# EAGLE design Ahmeduino Project (EAGLE 9.5.1)
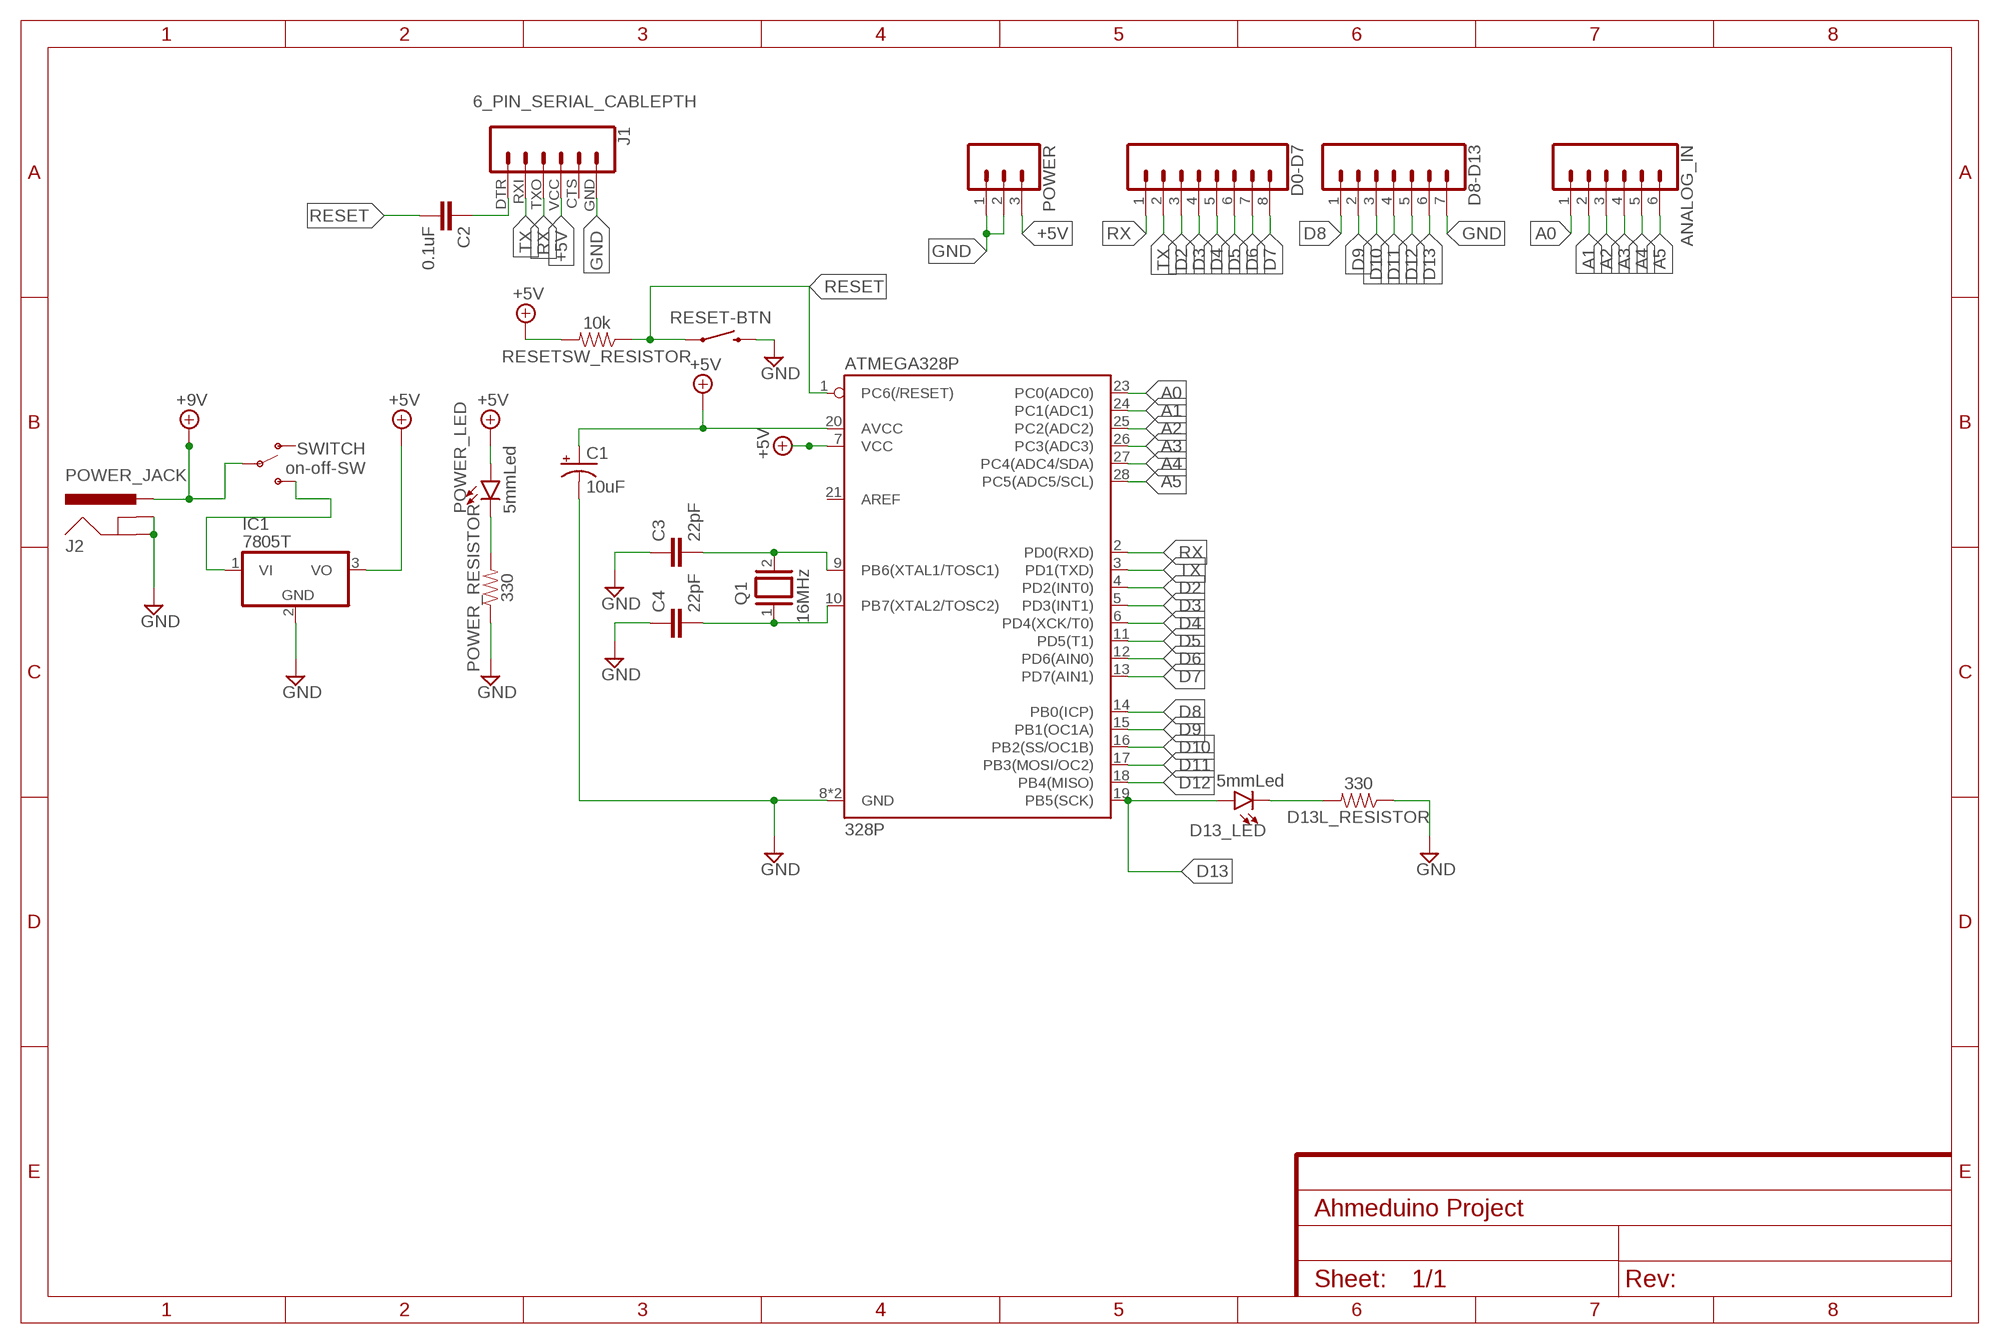
[diagram p0: schematic, sheet 1]

## Parts
ANALOG_IN  CONN_06LONGPADS  [1X06_LONGPADS]
ATMEGA328P  328P  ATMEGA328P_PDIP  [DIP28]
C1  10uF  10UF-POLAR-RADIAL-2.5MM-25V-20%  [CPOL-RADIAL-2.5MM-5MM]
C2  0.1uF  0.1UF-KIT-EZ-50V-20%  [CAP-PTH-SMALL-KIT]
C3  22pF  22PF-PTH-2.54MM-200V-5%  [CAP-PTH-2.54]
C4  22pF  22PF-PTH-2.54MM-200V-5%  [CAP-PTH-2.54]
D0-D7  CONN_08LONGPADS  [1X08_LONGPADS]
D8-D13  CONN_07LONGPADS  [1X07_LONGPADS]
D13_LED  5mmLed  LED5MM  [LED_5MM]
D13L_RESISTOR  330  330OHM-HORIZ-1/10W-5%  [AXIAL-0.3]
IC1  7805T  [TO220H]
J1  6_PIN_SERIAL_CABLEPTH  [FTDI_BASIC]
J2  POWER_JACK  [POWER_JACK_PTH]
POWER  CONN_03LONGPADS  [1X03_LONGPADS]
POWER_LED  5mmLed  LED5MM  [LED_5MM]
POWER_RESISTOR  330  330OHM-HORIZ-1/10W-5%  [AXIAL-0.3]
Q1  16MHz  XTAL/S  [QS]
RESET-BTN  ResetBtn  MOMENTARY-SWITCH-SPST-PTH-6.0MM  [TACTILE_SWITCH_PTH_6.0MM]
RESETSW_RESISTOR  10k  10KOHM-HORIZ-1/4W-1%  [AXIAL-0.3]
SWITCH  on-off-SW  SWITCH-SPDT-PTH-11.6X4.0MM  [SWITCH_SPDT_PTH_11.6X4.0MM]

## Nets
+5V: ATMEGA328P.7(VCC) ATMEGA328P.20(AVCC) C1.1(+) IC1.3(VO) J1.VCC POWER.3 POWER_LED.A RESETSW_RESISTOR.P$2
+9V: J2.PWR SWITCH.2(P)
A0: ANALOG_IN.1 ATMEGA328P.23(PC0(ADC0))
A1: ANALOG_IN.2 ATMEGA328P.24(PC1(ADC1))
A2: ANALOG_IN.3 ATMEGA328P.25(PC2(ADC2))
A3: ANALOG_IN.4 ATMEGA328P.26(PC3(ADC3))
A4: ANALOG_IN.5 ATMEGA328P.27(PC4(ADC4/SDA))
A5: ANALOG_IN.6 ATMEGA328P.28(PC5(ADC5/SCL))
D2: ATMEGA328P.4(PD2(INT0)) D0-D7.3
D3: ATMEGA328P.5(PD3(INT1)) D0-D7.4
D4: ATMEGA328P.6(PD4(XCK/T0)) D0-D7.5
D5: ATMEGA328P.11(PD5(T1)) D0-D7.6
D6: ATMEGA328P.12(PD6(AIN0)) D0-D7.7
D7: ATMEGA328P.13(PD7(AIN1)) D0-D7.8
D8: ATMEGA328P.14(PB0(ICP)) D8-D13.1
D9: ATMEGA328P.15(PB1(OC1A)) D8-D13.2
D10: ATMEGA328P.16(PB2(SS/OC1B)) D8-D13.3
D11: ATMEGA328P.17(PB3(MOSI/OC2)) D8-D13.4
D12: ATMEGA328P.18(PB4(MISO)) D8-D13.5
D13: ATMEGA328P.19(PB5(SCK)) D8-D13.6 D13_LED.A
GND: ATMEGA328P.8(GND) ATMEGA328P.22(GND) C1.2(-) C3.1 C4.1 D8-D13.7 D13L_RESISTOR.P$1 IC1.2(GND) J1.GND J2.GND J2.GNDBREAK POWER.1 POWER.2 POWER_RESISTOR.P$1 RESET-BTN.3
N$1: ATMEGA328P.9(PB6(XTAL1/TOSC1)) C3.2 Q1.2
N$2: ATMEGA328P.10(PB7(XTAL2/TOSC2)) C4.2 Q1.1
N$3: C2.1 J1.DTR
N$4: IC1.1(VI) SWITCH.3(S)
N$5: POWER_LED.K(C) POWER_RESISTOR.P$2
N$6: D13_LED.K(C) D13L_RESISTOR.P$2
RESET: ATMEGA328P.1(PC6(/RESET)) C2.2 RESET-BTN.1 RESETSW_RESISTOR.P$1
RX: ATMEGA328P.2(PD0(RXD)) D0-D7.1 J1.TXO
TX: ATMEGA328P.3(PD1(TXD)) D0-D7.2 J1.RXI
Unconnected: ATMEGA328P.21(AREF) J1.CTS SWITCH.1(O)

## Library data of the parts
ANALOG_IN = SparkFun-Connectors:CONN_06: Multi connection point. Often used as Generic Header-pin footprint for 0.1 inch spaced/style header connections On any of the 0.1 inch spaced packages, you can populate with these: Break Away Headers - Straight <https://www.sparkfun.com/products/116> (PRT-00116) Break Away Male Headers - Right Angle <https://www.sparkfun.com/products/553> (PRT-00553) Female Headers <https://www.sparkfun.com/products/115> (PRT-00115) Break Away Headers - Machine Pin <https://www.sparkfun.com/products/117> (PRT-00117) Break Away Female Headers - Swiss Machine Pin <https://www.sparkfun.com/products/743> (PRT-00743) Arduino Stackable Header - 6 Pin <https://www.sparkfun.com/products/9280> (PRT-09280) For SCREWTERMINALS and SPRING TERMINALS visit here: Screw Terimnals on SparkFun.com <https://www.sparkfun.com/search/results?term=Screw+Terminals> (5mm/3.5mm/2.54mm spacing) This device is also useful as a general connection point to wire up your design to another part of your project. Our various solder wires solder well into these plated through hole pads. Hook-Up Wire - Assortment (Stranded, 22 AWG) <https://www.sparkfun.com/products/11375> (PRT-11375) Hook-Up Wire - Assortment (Solid Core, 22 AWG) <https://www.sparkfun.com/products/11367> (PRT-11367) View the entire wire category on our website here <https://www.sparkfun.com/categories/141>
ATMEGA328P = SparkFun-IC-Microcontroller:ATMEGA328P_PDIP: Atmel 328P Through hole ATMEGA328P uC used in the Arduino 32kb flash, 1k EEPROM, 2k SRAM Datasheet <http://www.sparkfun.com/datasheets/Components/SMD/ATMega328.pdf> SparkFun Products Storefront component: AVR 28 Pin 20MHz 32K 6A/D - ATMega328P <https://www.sparkfun.com/products/9061> (COM-09061) SparkFun Simon Says - Through-Hole Soldering Kit <https://www.sparkfun.com/products/10547> (KIT-10547) SparkFun Learn to Solder - Simon Says <https://www.sparkfun.com/products/13708> (KIT-13708) SparkFun BigTime Watch Kit <https://www.sparkfun.com/products/11734> (KIT-11734) SparkFun ClockIt <https://www.sparkfun.com/products/10930> (KIT-10930) SparkFun Serial Enabled LCD Kit <https://www.sparkfun.com/products/10097> (LCD-10097) SparkFun Simon Tilts - Through Hole Soldering Kit <https://www.sparkfun.com/products/12634> (KIT-12634) SparkFun Frequency Counter Kit <https://www.sparkfun.com/products/10140> (KIT-10140) FabFM Radio Kit <https://www.sparkfun.com/products/11043> (KIT-11043) SparkFun Binary Blaster Kit <https://www.sparkfun.com/products/12037> (KIT-12037) SparkFun Metro-Gnome <https://www.sparkfun.com/products/9236> (KIT-09236) ATmega328 with Arduino Optiboot (Uno) <https://www.sparkfun.com/products/10524> (DEV-10524); PROD_ID: IC-09136
C1 = SparkFun-Capacitors:10UF-POLAR: 10.0µF polarized capacitors A capacitor is a passive two-terminal electrical component used to store electrical energy temporarily in an electric field.; PROD_ID: CAP-08440
C2 = SparkFun-Capacitors:0.1UF: 0.1µF ceramic capacitors A capacitor is a passive two-terminal electrical component used to store electrical energy temporarily in an electric field.; PROD_ID: CAP-08370
C3 C4 = SparkFun-Capacitors:22PF: 22pF ceramic capacitors A capacitor is a passive two-terminal electrical component used to store electrical energy temporarily in an electric field.; PROD_ID: CAP-09128
D0-D7 = SparkFun-Connectors:CONN_08: Multi connection point. Often used as Generic Header-pin footprint for 0.1 inch spaced/style header connections On any of the 0.1 inch spaced packages, you can populate with these: Break Away Headers - Straight <https://www.sparkfun.com/products/116> (PRT-00116) Break Away Male Headers - Right Angle <https://www.sparkfun.com/products/553> (PRT-00553) Female Headers <https://www.sparkfun.com/products/115> (PRT-00115) Break Away Headers - Machine Pin <https://www.sparkfun.com/products/117> (PRT-00117) Break Away Female Headers - Swiss Machine Pin <https://www.sparkfun.com/products/743> (PRT-00743) Arduino Stackable Header - 8 Pin <https://www.sparkfun.com/products/9279> (PRT-09279) For SCREWTERMINALS and SPRING TERMINALS visit here: Screw Terimnals on SparkFun.com <https://www.sparkfun.com/search/results?term=Screw+Terminals> (5mm/3.5mm/2.54mm spacing) This device is also useful as a general connection point to wire up your design to another part of your project. Our various solder wires solder well into these plated through hole pads. Hook-Up Wire - Assortment (Stranded, 22 AWG) <https://www.sparkfun.com/products/11375> (PRT-11375) Hook-Up Wire - Assortment (Solid Core, 22 AWG) <https://www.sparkfun.com/products/11367> (PRT-11367) View the entire wire category on our website here <https://www.sparkfun.com/categories/141> Special notes: Molex polarized connector foot print use with SKU : PRT-08231 with associated crimp pins and housings. 1MM SMD Version SKU: PRT-10208 NOTES ON THE VARIANTS LOCK and LOCK_LONGPADS... This footprint was designed to help hold the alignment of a through-hole component (i.e. 6-pin header) while soldering it into place. You may notice that each hole has been shifted either up or down by 0.005 of an inch from it's more standard position (which is a perfectly straight line). This slight alteration caused the pins (the squares in the middle) to touch the edges of the holes. Because they are alternating, it causes a "brace" to hold the component in place. 0.005 has proven to be the perfect amount of "off-center" position when using our standard breakaway headers. Although looks a little odd when you look at the bare footprint, once you have a header in there, the alteration is very hard to notice. Also,if you push a header all the way into place, it is covered up entirely on the bottom side.
D8-D13 = SparkFun-Connectors:CONN_07: Multi connection point. Often used as Generic Header-pin footprint for 0.1 inch spaced/style header connections On any of the 0.1 inch spaced packages, you can populate with these: Break Away Headers - Straight <https://www.sparkfun.com/products/116> (PRT-00116) Break Away Male Headers - Right Angle <https://www.sparkfun.com/products/553> (PRT-00553) Female Headers <https://www.sparkfun.com/products/115> (PRT-00115) Break Away Headers - Machine Pin <https://www.sparkfun.com/products/117> (PRT-00117) Break Away Female Headers - Swiss Machine Pin <https://www.sparkfun.com/products/743> (PRT-00743) For SCREWTERMINALS and SPRING TERMINALS visit here: Screw Terimnals on SparkFun.com <https://www.sparkfun.com/search/results?term=Screw+Terminals> (5mm/3.5mm/2.54mm spacing) This device is also useful as a general connection point to wire up your design to another part of your project. Our various solder wires solder well into these plated through hole pads. Hook-Up Wire - Assortment (Stranded, 22 AWG) <https://www.sparkfun.com/products/11375> (PRT-11375) Hook-Up Wire - Assortment (Solid Core, 22 AWG) <https://www.sparkfun.com/products/11367> (PRT-11367) View the entire wire category on our website here <https://www.sparkfun.com/categories/141> Special notes: Molex polarized connector foot print use with SKU : PRT-08231 with associated crimp pins and housings. 1MM SMD Version SKU: PRT-10208 NOTES ON THE VARIANTS LOCK and LOCK_LONGPADS... This footprint was designed to help hold the alignment of a through-hole component (i.e. 6-pin header) while soldering it into place. You may notice that each hole has been shifted either up or down by 0.005 of an inch from it's more standard position (which is a perfectly straight line). This slight alteration caused the pins (the squares in the middle) to touch the edges of the holes. Because they are alternating, it causes a "brace" to hold the component in place. 0.005 has proven to be the perfect amount of "off-center" position when using our standard breakaway headers. Although looks a little odd when you look at the bare footprint, once you have a header in there, the alteration is very hard to notice. Also,if you push a header all the way into place, it is covered up entirely on the bottom side.
D13_LED POWER_LED = SparkFun-LED:LED: LED (Generic) Standard schematic elements and footprints for 5mm, 3mm, 1206, and 0603 sized LEDs. Generic LEDs with no color specified.
D13L_RESISTOR POWER_RESISTOR = SparkFun-Resistors:330OHM: 330Ω resistor A resistor is a passive two-terminal electrical component that implements electrical resistance as a circuit element. Resistors act to reduce current flow, and, at the same time, act to lower voltage levels within circuits. - Wikipedia; PROD_ID: RES-8371
IC1 = linear:78*: Positive VOLTAGE REGULATOR Source: http://cache.national.com/ds/LM/LM78L05.pdf http://www.fairchildsemi.com/ds/LM/LM7805.pdf
J1 = SparkFun-Connectors:6_PIN_SERIAL_CABLE: 6-pin header connection for use with the "FTDI BASIC" pinout - CABLE SIDE. Also known as "Arduino Serial Program Header". This is used on a design to provide a 6-pin connection point for serial communication usually from a USB cable (D+/D-) to these headers (RX/TX). It also has the remaining pins necessary for programming in the Arduino evironment (DTR, GND, and sometimes VCC). Note, this device has "CABLE" in the name. It is intended to be used on a design that usually lives on the end of your USB cable and prvides the converter chip (FTDI232 or FTDI231x) to commnicate serial RX/TX. The "sister" device, named "TARGET" is inteneded to be used on a design that contains a target micro-controller that you wish to program. You can populate with some of these: Female Headers <https://www.sparkfun.com/products/115> (PRT-00115) For reference (or to suit your programming needs) check out these designs: SparkFun FTDI Basic Breakout - 5V <https://www.sparkfun.com/products/9716> (DEV-09716) SparkFun FTDI Basic Breakout - 3.3V <https://www.sparkfun.com/products/9873> (DEV-09873) SparkFun FTDI SmartBasic <https://www.sparkfun.com/products/12935> (DEV-12935) SparkFun Beefy 3 - FTDI Basic Breakout <https://www.sparkfun.com/products/13746> (DEV-13746)
J2 = SparkFun-Connectors:POWER_JACK: Power Jack Connector This is the standard 5.5mm barrel jack for power. The PTH is the most common, proven, reliable, footprint. The Slot footprint only works if the mill layer is transmitted to the PCB fab house so be warned. Here are the connectors we sell at SparkFun: DC Barrel Power Jack/Connector <https://www.sparkfun.com/products/119> (PRT-00119) DC Barrel Power Jack/Connector (SMD) <https://www.sparkfun.com/products/12748> (PRT-12748) DC Barrel Jack Adapter - Breadboard Compatible <https://www.sparkfun.com/products/10811> (PRT-10811) It is used on this SparkFun product (and many, many others): SparkFun RedBoard - Programmed with Arduino <https://www.sparkfun.com/products/12757> (DEV-12757) Also, if you need a mating power supply or connector, please check these out: Wall Adapter Power Supply - 9VDC 650mA <https://www.sparkfun.com/products/298> (TOL-00298) DC Barrel Jack Adapter - Male <https://www.sparkfun.com/products/10287> (PRT-10287); PROD_ID: CONN-08197
POWER = SparkFun-Connectors:CONN_03: Multi connection point. Often used as Generic Header-pin footprint for 0.1 inch spaced/style header connections On any of the 0.1 inch spaced packages, you can populate with these: Break Away Headers - Straight <https://www.sparkfun.com/products/116> (PRT-00116) Break Away Male Headers - Right Angle <https://www.sparkfun.com/products/553> (PRT-00553) Female Headers <https://www.sparkfun.com/products/115> (PRT-00115) Break Away Headers - Machine Pin <https://www.sparkfun.com/products/117> (PRT-00117) Break Away Female Headers - Swiss Machine Pin <https://www.sparkfun.com/products/743> (PRT-00743) Stackable Header - 3 Pin (Female, 0.1") <https://www.sparkfun.com/products/13875> (PRT-13875) For SCREWTERMINALS and SPRING TERMINALS visit here: Screw Terimnals on SparkFun.com <https://www.sparkfun.com/search/results?term=Screw+Terminals> (5mm/3.5mm/2.54mm spacing) This device is also useful as a general connection point to wire up your design to another part of your project. Our various solder wires solder well into these plated through hole pads. Hook-Up Wire - Assortment (Stranded, 22 AWG) <https://www.sparkfun.com/products/11375> (PRT-11375) Hook-Up Wire - Assortment (Solid Core, 22 AWG) <https://www.sparkfun.com/products/11367> (PRT-11367) View the entire wire category on our website here <https://www.sparkfun.com/categories/141> Special notes: Molex polarized connector foot print use with SKU : PRT-08232 with associated crimp pins and housings.
Q1 = special:XTAL/S: CRYSTAL
RESET-BTN = SparkFun-Switches:MOMENTARY-SWITCH-SPST: Momentary Switch (Pushbutton) - SPST Normally-open (NO) SPST momentary switches (buttons, pushbuttons). Variants PTH-12MM - 12mm square, through-hole Momentary Pushbutton Switch - 12mm Square <https://www.sparkfun.com/products/9190> (COM-09190) PTH-6.0MM, PTH-6.0MM-KIT - 6.0mm square, through-hole Mini Pushbutton Switch <https://www.sparkfun.com/products/97> (COM-00097) KIT package intended for soldering kit's - only one side of pads' copper is exposed. PTH-RIGHT-ANGLE-KIT - Right-angle, through-hole Right Angle Tactile Button <https://www.sparkfun.com/products/10791> - Used on SparkFun BigTime Watch Kit <https://www.sparkfun.com/products/11734> SMD-12MM - 12mm square, surface-mount Tactile Button - SMD (12mm) <https://www.sparkfun.com/products/12993> (COM-12993) Used on SparkFun PicoBoard <https://www.sparkfun.com/products/11888> SMD-4.5MM - 4.5mm Square Trackball Switch Used on SparkFun Blackberry Trackballer Breakout <https://www.sparkfun.com/products/13169> SMD-4.6MMX2.8MM - 4.60mm x 2.80mm, surface mount Used on SparkFun SAMD21 Mini Breakout <https://www.sparkfun.com/products/13664> SMD-5.2MM, SMD-5.2-REDUNDANT - 5.2mm square, surface-mount Mini Pushbutton Switch - SMD <https://www.sparkfun.com/products/8720> (COM-08720) Used on Arduino Pro Mini <https://www.sparkfun.com/products/11114> REDUNDANT package connects both switch circuits together SMD-6.0X3.5MM - 6.0 x 3.5mm, surface mount Momentary Reset Switch SMD <https://www.sparkfun.com/products/8229> (COM-08229) SMD-6.2MM-TALL - 6.2mm square, surface mount Tactile Button - SMD (6mm) <https://www.sparkfun.com/products/12992> Used on SparkFun Digital Sandbox <https://www.sparkfun.com/products/12651> SMD-RIGHT-ANGLE - Right-angle, surface mount Used on SparkFun Block for Intel® Edison - Arduino <https://www.sparkfun.com/products/13036>; PROD_ID: SWCH-08441; SF_SKU: COM-00097
RESETSW_RESISTOR = SparkFun-Resistors:10KOHM: 10kΩ resistor A resistor is a passive two-terminal electrical component that implements electrical resistance as a circuit element. Resistors act to reduce current flow, and, at the same time, act to lower voltage levels within circuits. - Wikipedia; PROD_ID: RES-12183
SWITCH = SparkFun-Switches:SWITCH-SPDT: Single Pole, Double Throw (SPDT) Switch Single-pole, double-throw (SPDT) switch. Variant Overview SMD-AYZ0202 Surface Mount DPDT Switch <https://www.sparkfun.com/products/597> (COM-00597) Used on e.g. LilyPad Arduino USB - ATmega32U4 Board <https://www.sparkfun.com/products/12049> PTH-11.6X4.0MM SPDT Mini Power Switch <https://www.sparkfun.com/products/102> (COM-00102) Used on e.g. SparkFun Simon Says - Through-Hole Soldering Kit <https://www.sparkfun.com/products/10547> (KIT-10547) PTH-11.6X4.0MM-KIT KIT version of SPDT Mini Power Switch - Simplifies soldering by removing tStop of switch pins - only one side can be soldered. PTH-11.6X4.0MM-LOCK LOCK version of SPDT Mini Power Switch - Offset pins hold switch in place for easier soldering. SMD-RIGHT-ANGLE Surface Mount Right Angle Switch <https://www.sparkfun.com/products/10860> (COM-10860) Used on e.g. SparkFun ESP8266 Thing <https://www.sparkfun.com/products/13231>; PROD_ID: SWCH-08261; SF_SKU: COM-00102

## Board
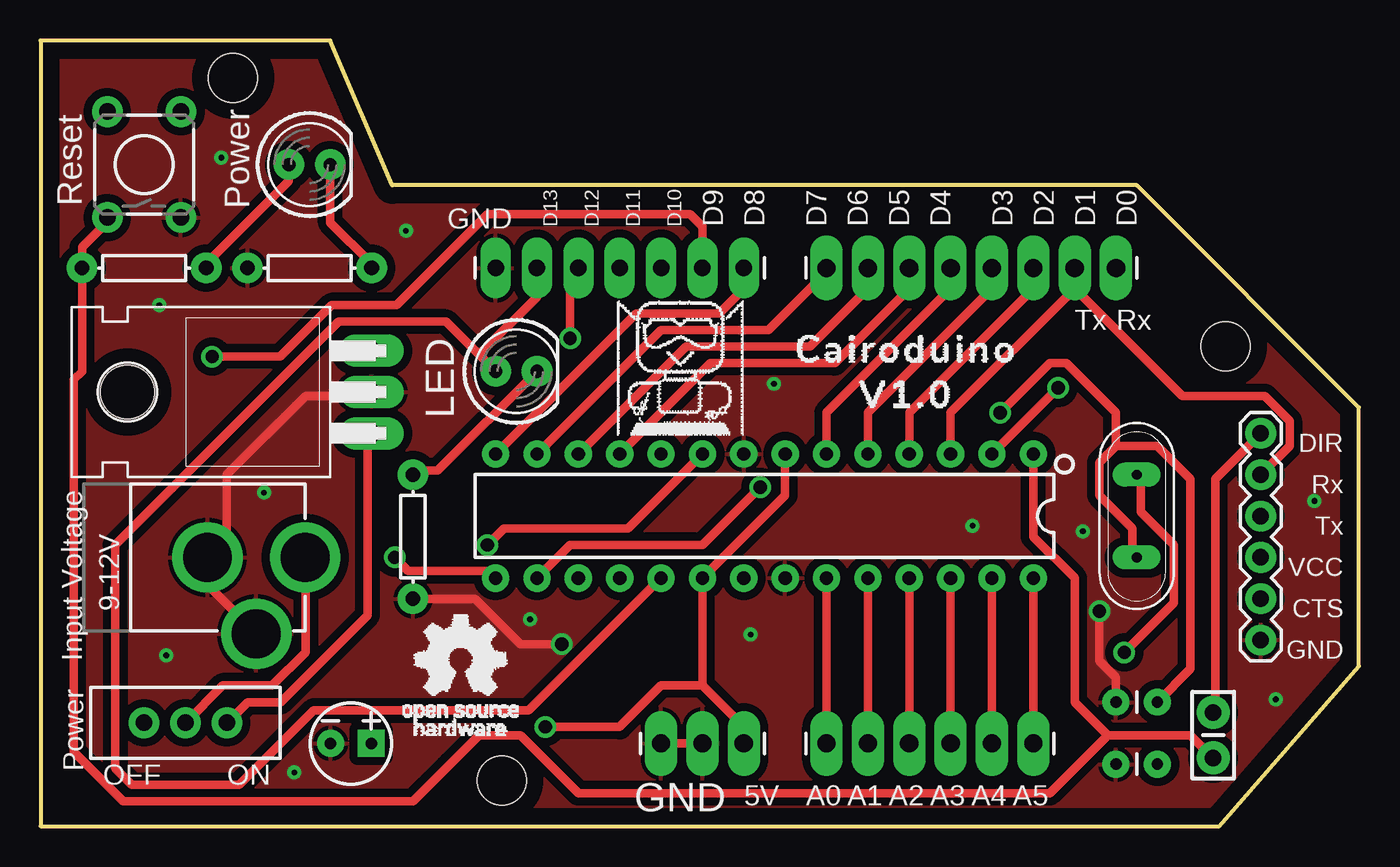
[diagram p1: board, top side]
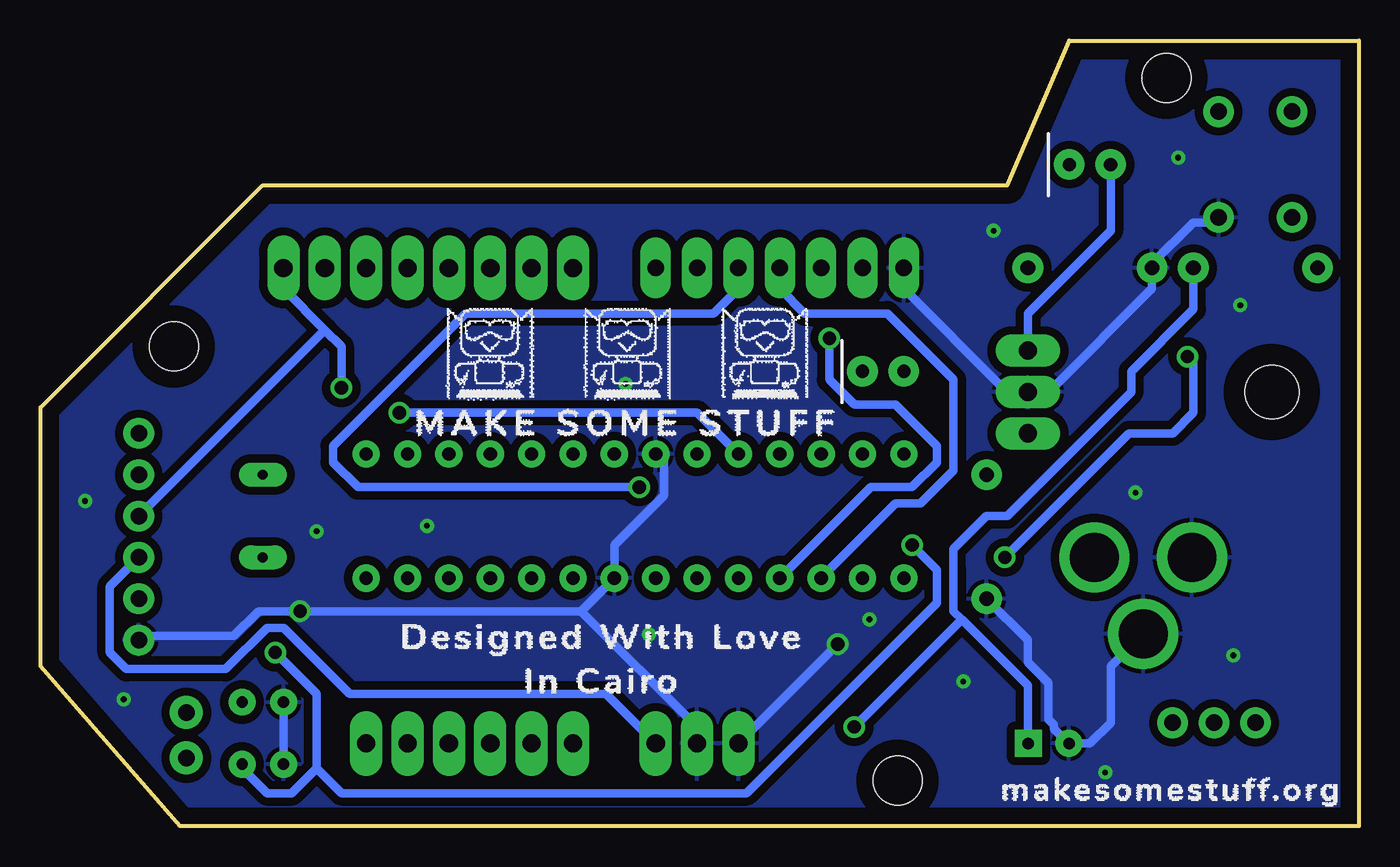
[diagram p2: board, bottom side, seen from below]

Size 80.95 x 48.25 mm. Coordinates in mm from the lower left corner, seen from the top.
Outline: 0,0 72.39,0 80.95,9.83 80.95,25.73 67.32,39.36 21.59,39.37 17.79,48.25 0,48.25 0,0
Copper layers (1*16): Top 0.035mm / dielectric 1.5mm / Bottom 0.035mm
Design rules "default *": minimum track width 20mil, minimum drill 0.8mm, track to track 20mil, track to pad 20mil, pad to pad 20mil, via to via 20mil, smd to smd 20mil, copper to edge 40mil, drill to drill 6mil, minimum pad ring 17mil, minimum via ring 10mil, stop-mask expansion 4mil, vias tented up to drill 0mil, thermal gap 10mil
Holes 3 mm at 11.81,45.97 28.32,2.79 72.77,29.46

### Footprints (pad centres in the part's own frame; a part is rotated, then mirrored left to right if it is on the bottom)
1X06_LONGPADS = drill 1.118 pad 1.88 long: 1 0,0; 2 2.54,0; 3 5.08,0; 4 7.62,0; 5 10.16,0; 6 12.7,0
DIP28 = drill 0.813 pad 1.626: 1 -16.51,-3.81; 2 -13.97,-3.81; 3 -11.43,-3.81; 4 -8.89,-3.81; 5 -6.35,-3.81; 6 -3.81,-3.81; 7 -1.27,-3.81; 8 1.27,-3.81; 9 3.81,-3.81; 10 6.35,-3.81; 11 8.89,-3.81; 12 11.43,-3.81; 13 13.97,-3.81; 14 16.51,-3.81; 15 16.51,3.81; 16 13.97,3.81; 17 11.43,3.81; 18 8.89,3.81; 19 6.35,3.81; 20 3.81,3.81; 21 1.27,3.81; 22 -1.27,3.81; 23 -3.81,3.81; 24 -6.35,3.81; 25 -8.89,3.81; 26 -11.43,3.81; 27 -13.97,3.81; 28 -16.51,3.81
CPOL-RADIAL-2.5MM-5MM = drill 0.7 pad 1.651 square: 1 1.25,0 | drill 0.7 pad 1.651: 2 -1.25,0
CAP-PTH-SMALL-KIT = drill 1.016 pad 2.032: 1 -1.397,0; 2 1.397,0
CAP-PTH-2.54 = drill 0.7 pad 1.651: 1 -1.27,0; 2 1.27,0
1X08_LONGPADS = drill 1.118 pad 1.88 long: 1 0,0; 2 2.54,0; 3 5.08,0; 4 7.62,0; 5 10.16,0; 6 12.7,0; 7 15.24,0; 8 17.78,0
1X07_LONGPADS = drill 1.016 pad 1.88 long: 1 0,0; 2 2.54,0; 3 5.08,0; 4 7.62,0; 5 10.16,0; 6 12.7,0; 7 15.24,0
LED_5MM = drill 0.813 pad 1.88: A -1.27,0; K 1.27,0
AXIAL-0.3 = drill 0.9 pad 1.88: P$1 -3.81,0; P$2 3.81,0
TO220H = drill 1.118 long: 1 -2.54,-10.16; 2 0,-10.16; 3 2.54,-10.16 | hole 3.302: 0,4.826
FTDI_BASIC = drill 1.016 pad 1.88: CTS 10.16,0; DTR 0,0; GND 12.7,0; RXI 2.54,0; TXO 5.08,0; VCC 7.62,0
POWER_JACK_PTH = drill 2.997 pad 4.318: GND 0,7.7; GNDBREAK 4.7,10.7; PWR 0,13.7
1X03_LONGPADS = drill 1.118 pad 1.88 long: 1 0,0; 2 2.54,0; 3 5.08,0
QS = drill 0.61 long: 1 -2.54,0; 2 2.54,0
TACTILE_SWITCH_PTH_6.0MM = drill 1.016 pad 1.88: 1 -3.251,2.261; 2 3.251,2.261; 3 -3.251,-2.261; 4 3.251,-2.261
SWITCH_SPDT_PTH_11.6X4.0MM = drill 1.016 pad 1.88: 1 0,2.54; 2 0,0; 3 0,-2.54

### Placement (x,y rotation side)
ANALOG_IN  48.26,5.08 0 top
ATMEGA328P  44.45,19.05 180 top
C1  19.05,5.08 0 top
C2  72.01,5.59 270 top
C3  67.31,3.81 0 top
C4  67.31,7.62 0 top
D0-D7  66.04,34.29 180 top
D8-D13  43.18,34.29 180 top
D13_LED  29.21,27.94 0 top
D13L_RESISTOR  22.86,17.78 90 top
IC1  10.16,26.67 90 top
J1  74.93,24.13 270 top
J2  2.54,16.51 270 top
POWER  38.1,5.08 0 top
POWER_LED  16.51,40.64 0 top
POWER_RESISTOR  16.51,34.29 0 top
Q1  67.31,19.05 90 top
RESET-BTN  6.35,40.64 90 top
RESETSW_RESISTOR  6.35,34.29 0 top
SWITCH  8.89,6.35 90 top

### Tracks (layer width: path | path; a pad name or v marks a point on that pad's centre or on a via)
+5V  (via drill 0.81)
  Top 0.508: POWER_LED.A 15.24,39.62 10.16,34.54 RESETSW_RESISTOR.P$2 | ATMEGA328P.7 45.72,20.32 ATMEGA328P.20 40.64,8.64 | 40.64,8.64 43.18,6.1 POWER.3 | v30.99,6.1 35.56,6.1 38.1,8.64 40.64,8.64
  Bottom 0.508: 24.38,12.7 24.89,13.21 24.89,15.24 24.89,15.75 24.89,17.02 22.86,19.05 21.59,19.05 13.97,26.67 13.97,27.94 10.16,31.75 RESETSW_RESISTOR.P$2 | 24.38,12.7 20.32,8.64 20.32,5.08 C1.1 | IC1.3 20.32,31.5 15.24,36.58 POWER_LED.A | J1.VCC 76.71,14.73 76.71,10.67 75.69,9.65 69.6,9.65 67.06,12.19 66.04,12.19 61.98,8.13 46.23,8.13 POWER.3 | v30.99,6.1 24.38,12.7
+9V
  Top 0.508: J2.PWR 16.26,16.26 16.26,10.67 14.22,8.64 11.18,8.64 SWITCH.2
A0
  Top 0.508: ANALOG_IN.1 ATMEGA328P.23
A1
  Top 0.508: ANALOG_IN.2 ATMEGA328P.24
A2
  Top 0.508: ANALOG_IN.3 ATMEGA328P.25
A3
  Top 0.508: ANALOG_IN.4 ATMEGA328P.26
A4
  Top 0.508: ANALOG_IN.5 ATMEGA328P.27
A5
  Top 0.508: ANALOG_IN.6 ATMEGA328P.28
D2
  Top 0.508: ATMEGA328P.4 53.34,25.4 60.96,33.02 D0-D7.3
D3
  Top 0.508: ATMEGA328P.5 50.8,25.4 58.42,33.02 D0-D7.4
D4
  Top 0.508: ATMEGA328P.6 48.26,25.4 55.88,33.02 D0-D7.5
D5
  Top 0.508: ATMEGA328P.11 41.15,28.45 48.77,28.45 53.34,33.02 D0-D7.6
D6
  Top 0.508: ATMEGA328P.12 39.62,29.46 47.24,29.46 50.8,33.02 D0-D7.7
D7
  Top 0.508: ATMEGA328P.13 38.1,30.48 44.7,30.48 48.26,34.04 D0-D7.8
D8
  Top 0.508: ATMEGA328P.14 36.58,31.5 41.66,31.5 43.18,33.02 D8-D13.1
D9  (via drill 0.81)
  Top 0.508: D8-D13.2 40.64,36.83 39.88,37.59 27.43,37.59 21.84,32 17.87,32 14.71,28.84 v10.53,28.84 | v21.74,16.51 22.57,15.67 27.51,15.67 ATMEGA328P.15
  Bottom 0.508: v10.53,28.84 10.16,28.64 10.16,25.4 11.43,24.13 14.12,24.13 v21.74,16.51
D10  (via drill 0.81)
  Top 0.508: ATMEGA328P.16 32.51,17.27 40.64,17.27 v44.2,20.83
  Bottom 0.508: v44.2,20.83 61.47,20.83 62.99,22.35 62.99,23.37 54.86,31.5 39.62,31.5 38.1,33.02 D8-D13.3
D11
  Bottom 0.508: ATMEGA328P.17 28.45,19.81 26.92,19.81 24.89,21.84 24.89,27.43 28.96,31.5 34.04,31.5 35.56,33.02 D8-D13.4
D12  (via drill 0.81)
  Top 0.508: v32.51,29.97 32.51,33.53 33.02,34.04 D8-D13.5
  Bottom 0.508: ATMEGA328P.18 29.97,20.83 27.43,20.83 25.91,22.35 25.91,23.37 28.45,25.91 30.99,25.91 32.51,27.43 v32.51,29.97
D13
  Top 0.508: ATMEGA328P.19 29.97,7.11 16.76,7.11 12.19,2.54 5.59,2.54 4.57,3.56 4.57,17.27 18.29,30.99 24.89,30.99 26.92,28.96 | D13_LED.A 26.92,28.96 | D8-D13.6 30.48,32.51 26.92,28.96
GND  (via drill 0.35, 0.81)
  Top 0.508: IC1.2 20.32,26.42 16.26,26.42 11.43,21.59 11.43,17.7 J2.GND 10.24,14.81 J2.GNDBREAK | POWER.2 POWER.1 | C4.1 66.04,9.14 65.02,10.16 v65.02,13.21 | v32,11.18 29.46,11.18 26.67,13.97 D13L_RESISTOR.P$1
  Bottom 0.508: RESET-BTN.3 8.64,37.08 10.16,37.08 12.7,34.54 POWER_RESISTOR.P$1 12.7,33.02 18.8,26.92 20.32,26.92 | D8-D13.7 27.94,33.02 21.84,26.92 20.32,26.92 | 20.32,26.92 IC1.2 | C4.1 C3.1 | ATMEGA328P.8 42.67,22.35 42.67,20.32 45.72,17.27 ATMEGA328P.22 47.75,13.21 | 47.75,13.21 v65.02,13.21 67.56,13.21 69.09,11.68 74.68,11.68 J1.GND | POWER.2 40.64,6.1 47.75,13.21 | POWER.1 v32,11.18 | J2.GNDBREAK 15.24,9.81 15.24,6.35 16.51,5.08 C1.2 18.71,5.99 18.71,6.22 19.05,6.56 19.05,8.8 20.32,10.07 20.32,11.43 D13L_RESISTOR.P$1
  other vias: 7.7,10.5 13.71,20.49 7.28,32 11.09,41.06 22.43,36.57 45.04,27.18 57.23,18.46 43.6,11.77 64,18.12 78.22,19.98 75.85,7.79 30.05,12.7 24.3,8.89 15.58,3.3
  pour Bottom (isolate 0.406): 0,48.26 17.78,48.26 21.55,39.37 67.3,39.37 80.93,25.74 80.93,9.74 72.38,0 0,0 -0.08,0.08 -0.08,48.17
  pour Top (isolate 0.406): 0,48.26 17.78,48.26 21.67,39.37 67.3,39.37 80.93,25.74 80.93,9.82 72.38,0 0,0
N$1  (via drill 0.81)
  Top 0.508: v66.55,10.67 69.6,13.72 69.6,17.27 67.56,19.3 67.56,21.34 Q1.2 | ATMEGA328P.9 36.07,18.29 28.45,18.29 v27.43,17.27
  Bottom 0.508: v66.55,10.67 64.01,8.13 64.01,3.56 | 64.01,3.56 65.53,2.03 67.06,2.03 68.58,3.56 C3.2 | v27.43,17.27 25.91,15.75 25.91,13.72 37.59,2.03 62.48,2.03 64.01,3.56
N$2  (via drill 0.81)
  Top 0.508: 66.04,23.37 65.02,22.35 65.02,20.32 67.06,18.29 67.06,16.76 Q1.1 | 66.04,23.37 68.58,23.37 70.61,21.34 70.61,9.65 C4.2 | v58.93,25.4 61.98,28.45 62.99,28.45 66.04,25.4 66.04,23.37
  Bottom 0.508: ATMEGA328P.10 40.64,25.4 v58.93,25.4
N$3
  Top 0.508: J1.DTR 72.14,21.34 72.14,7.11 C2.1
N$4
  Top 0.508: IC1.1 20.07,23.88 20.07,12.95 14.73,7.62 12.7,7.62 SWITCH.3
N$5
  Top 0.508: POWER_LED.K 17.78,37.08 20.32,34.54 POWER_RESISTOR.P$2
N$6
  Top 0.508: D13_LED.K 24.38,21.84 22.86,21.84 D13L_RESISTOR.P$2
RESET
  Top 0.508: RESET-BTN.1 4.06,37.08 2.54,35.56 RESETSW_RESISTOR.P$1 2.54,27.94 2.03,27.43 2.03,4.57 5.08,1.52 22.86,1.52 26.92,5.59 29.46,5.59 33.02,2.03 61.98,2.03 65.53,5.59 | ATMEGA328P.1 60.96,17.78 63.5,15.24 63.5,7.62 65.53,5.59 | 65.53,5.59 70.61,5.59 C2.2
RX  (via drill 0.81)
  Top 0.508: v62.48,26.92 ATMEGA328P.2
  Bottom 0.508: v62.48,26.92 62.48,29.46 63.5,30.48 | 63.5,30.48 66.04,33.02 D0-D7.1 | 63.5,30.48 J1.TXO
TX
  Top 0.508: ATMEGA328P.3 55.88,25.4 63.5,33.02 | D0-D7.2 63.5,33.02 | J1.RXI 76.71,23.37 76.71,24.89 75.18,26.42 70.1,26.42 63.5,33.02

### Text on the board
tPlace: Power | Reset | GND | D13 | D12 | D11 | D10 | D9 | D8 | D7 | D6 | D5 | D4 | D3 | D2 | D1 | D0 | LED | Tx | Rx | DIR | Rx | Tx | VCC | CTS | 9-12V | GND | Input Voltage | Power | OFF | ON | GND | 5V | A0 | A1 | A2 | A3 | A4 | A5